# Altium schematic sheet РЕУН.468172.001_Драйвер лазера.SchDoc: =Name-1str
size 594 x 420 mm; SheetNumber: номер страницы; Вид изделия: Документация; Раздел: Документация; Код документа: Э3; Вид документа: Схема электрическая принципиальная; Класс документа: Конструкторский документ; Создавать изделие в PLM: Yes; DocumentCode: РЕУН.Э3; DocumentView: Схема электрическая принципиальная; DocumentClass: Конструкторский документ; ProductView: Документация
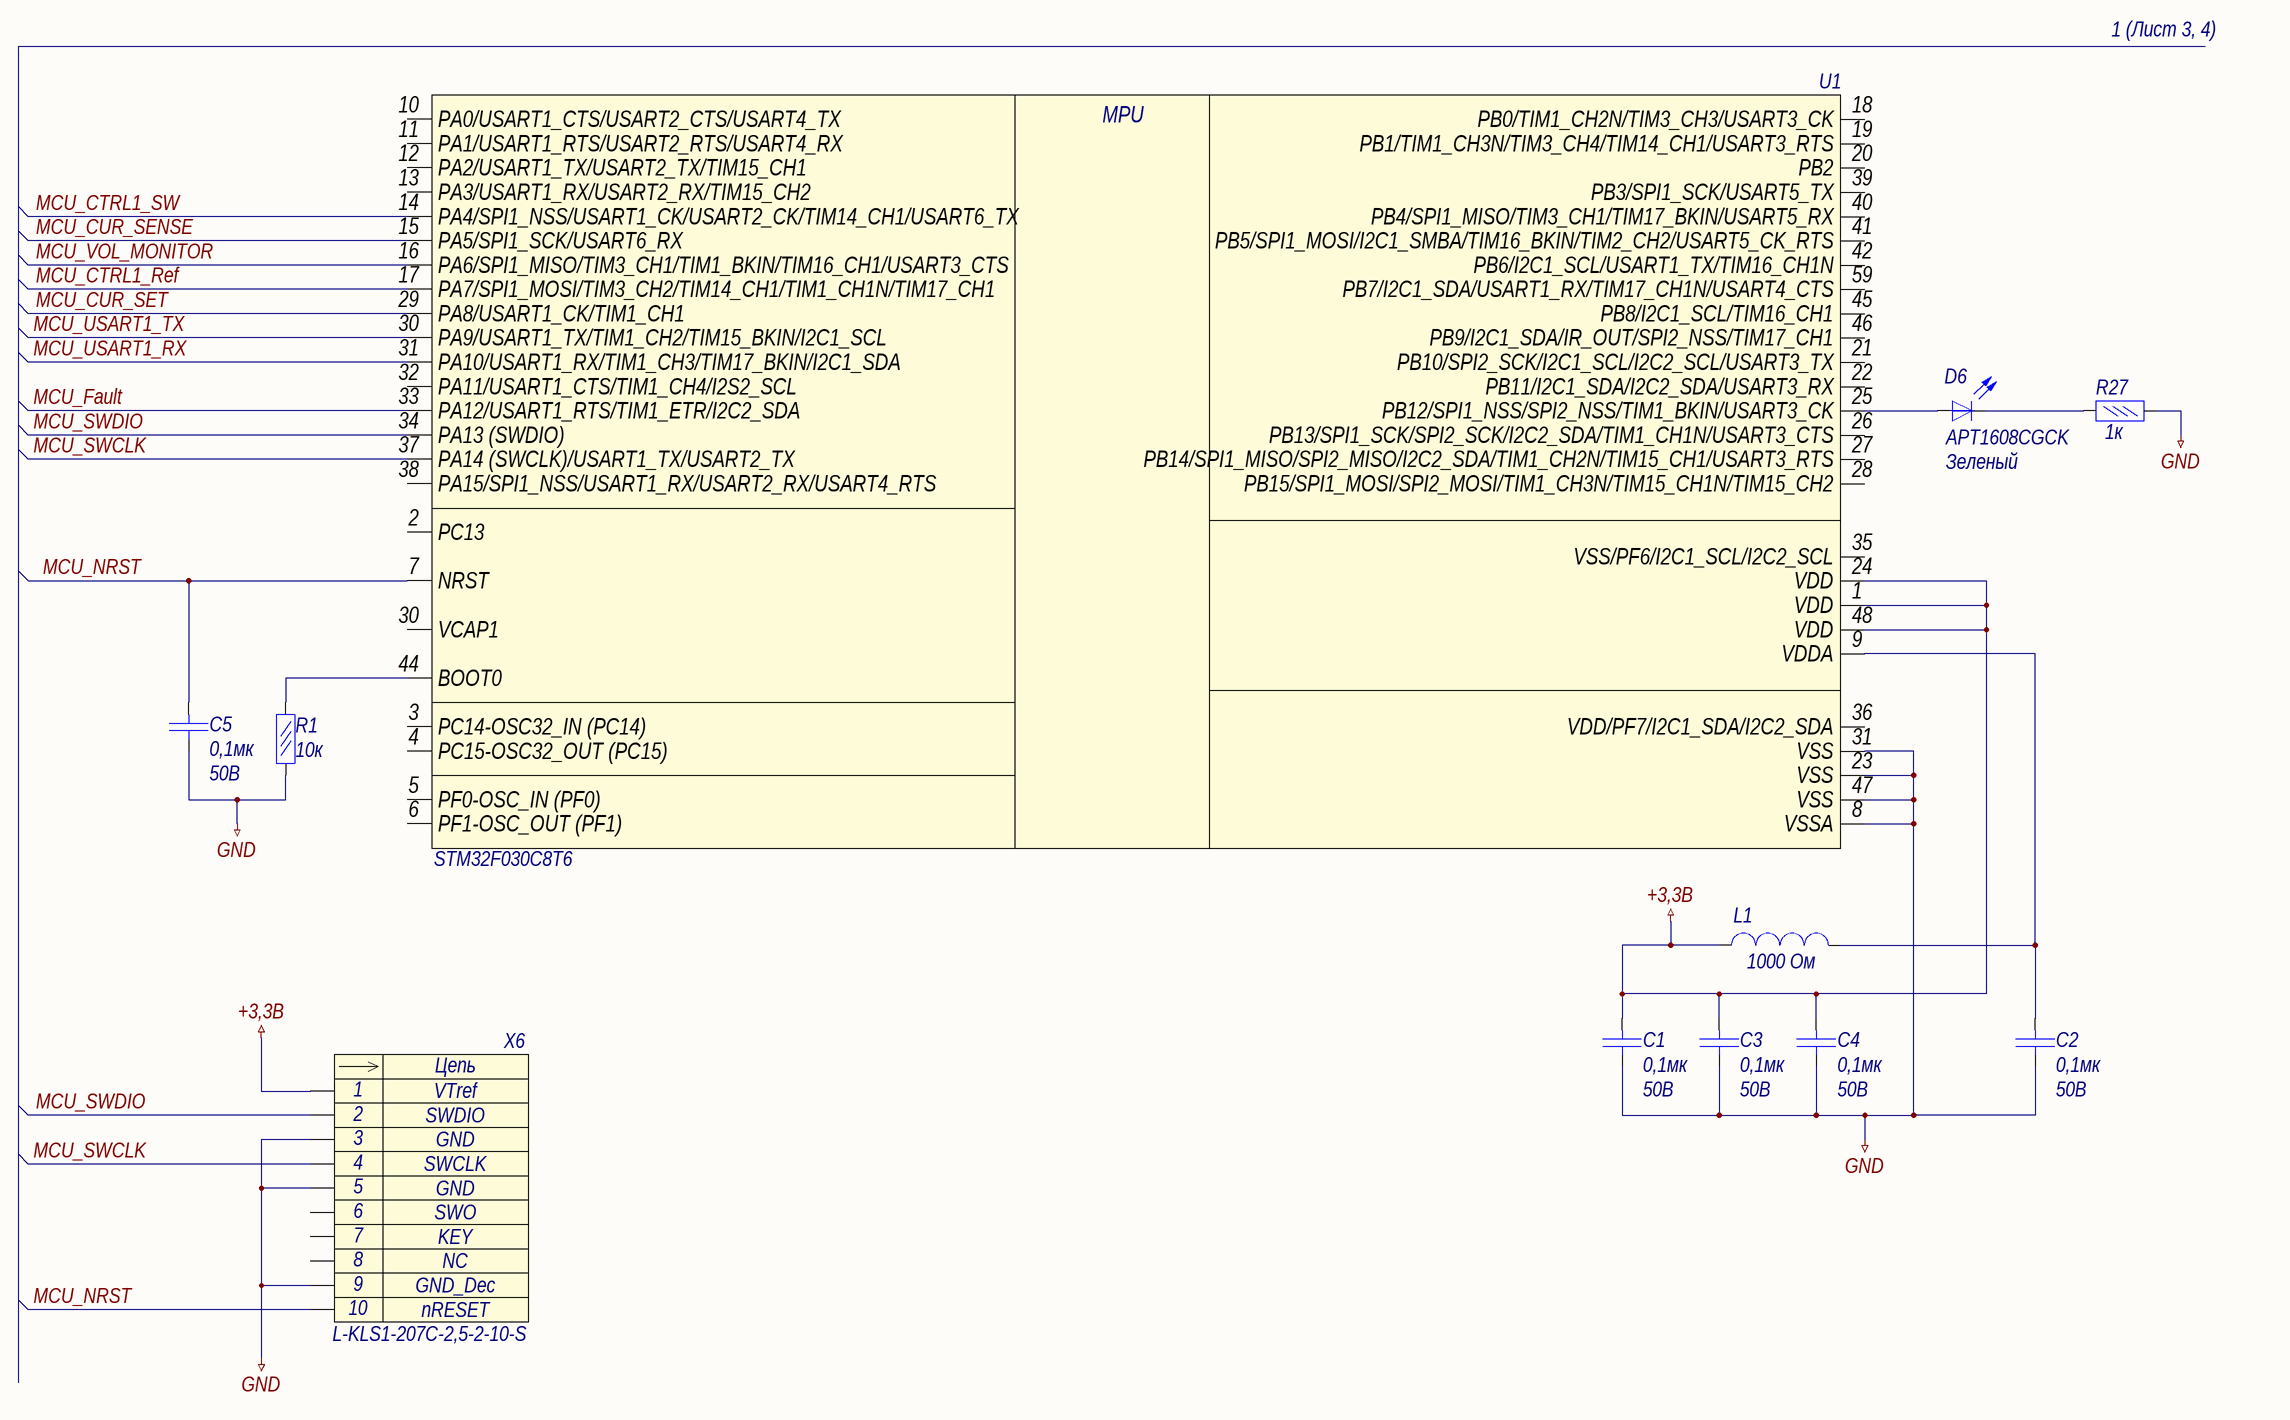
[diagram p0: РЕУН.468172.001_Драйвер лазера.SchDoc]

## Parts
C1  Voltage: 50В  [C0805_AA]  (hidden comment: 0,1мк)
C2  Voltage: 50В  [C0805_AA]  (hidden comment: 0,1мк)
C3  Voltage: 50В  [C0805_AA]  (hidden comment: 0,1мк)
C4  Voltage: 50В  [C0805_AA]  (hidden comment: 0,1мк)
C5  Voltage: 50В  [C0805_AA]  (hidden comment: 0,1мк)
D6  Color: Зеленый  (hidden comment: APT1608CGCK)
L1  1000 Ом  [L0603_A]
R1  10к  [R1206]
R27  1к  [R1206]
U1  STM32F030C8T6
X6  L-KLS1-207C-2,5-2-10-S

## Nets
+3,3В: C1.2 C3.2 C4.2 L1.1 U1.1(VDD) U1.24(VDD) U1.48(VDD) X6.1
GND: C1.1 C2.1 C3.1 C4.1 C5.1 R1.1 R27.1 U1.8(VSSA) U1.23(VSS) U1.31(VSS) U1.47(VSS) X6.3 X6.5 X6.9
MCU_CTRL1_Ref: U1.17(PA7/SPI1_MOSI/TIM3_CH2/TIM14_CH1/TIM1_CH1N/TIM17_CH1)
MCU_CTRL1_SW: U1.14(PA4/SPI1_NSS/USART1_CK/USART2_CK/TIM14_CH1/USART6_TX)
MCU_CUR_SENSE: U1.15(PA5/SPI1_SCK/USART6_RX)
MCU_CUR_SET: U1.29(PA8/USART1_CK/TIM1_CH1)
MCU_Fault: U1.33(PA12/USART1_RTS/TIM1_ETR/I2C2_SDA)
MCU_NRST: C5.2 U1.7(NRST) X6.10
MCU_SWCLK: U1.37(PA14_(SWCLK)/USART1_TX/USART2_TX) X6.4
MCU_SWDIO: U1.34(PA13_(SWDIO)) X6.2
MCU_USART1_RX: U1.31(PA10/USART1_RX/TIM1_CH3/TIM17_BKIN/I2C1_SDA)
MCU_USART1_TX: U1.30(PA9/USART1_TX/TIM1_CH2/TIM15_BKIN/I2C1_SCL)
MCU_VOL_MONITOR: U1.16(PA6/SPI1_MISO/TIM3_CH1/TIM1_BKIN/TIM16_CH1/USART3_CTS)
NetC2_2: C2.2 L1.2 U1.9(VDDA)
NetD6_1: D6.1(A) U1.25(PB12/SPI1_NSS/SPI2_NSS/TIM1_BKIN/USART3_CK)
NetD6_2: D6.2(K) R27.2
NetR1_2: R1.2 U1.44(BOOT0)

Not connected (* = marked no-connect by the designer): U1 2(PC13) 3(PC14-OSC32_IN_(PC14)) 4(PC15-OSC32_OUT_(PC15)) 5(PF0-OSC_IN_(PF0)) 6(PF1-OSC_OUT_(PF1)) 10(PA0/USART1_CTS/USART2_CTS/USART4_TX) 11(PA1/USART1_RTS/USART2_RTS/USART4_RX) 12(PA2/USART1_TX/USART2_TX/TIM15_CH1) 13(PA3/USART1_RX/USART2_RX/TIM15_CH2) 18(PB0/TIM1_CH2N/TIM3_CH3/USART3_CK) 19(PB1/TIM1_CH3N/TIM3_CH4/TIM14_CH1/USART3_RTS) 20(PB2) 21(PB10/SPI2_SCK/I2C1_SCL/I2C2_SCL/USART3_TX) 22(PB11/I2C1_SDA/I2C2_SDA/USART3_RX) 26(PB13/SPI1_SCK/SPI2_SCK/I2C2_SDA/TIM1_CH1N/USART3_CTS) 27(PB14/SPI1_MISO/SPI2_MISO/I2C2_SDA/TIM1_CH2N/TIM15_CH1/USART3_RTS) 28(PB15/SPI1_MOSI/SPI2_MOSI/TIM1_CH3N/TIM15_CH1N/TIM15_CH2) 32(PA11/USART1_CTS/TIM1_CH4/I2S2_SCL) 35(VSS/PF6/I2C1_SCL/I2C2_SCL) 36(VDD/PF7/I2C1_SDA/I2C2_SDA) 38(PA15/SPI1_NSS/USART1_RX/USART2_RX/USART4_RTS) 39(PB3/SPI1_SCK/USART5_TX) 40(PB4/SPI1_MISO/TIM3_CH1/TIM17_BKIN/USART5_RX) 41(PB5/SPI1_MOSI/I2C1_SMBA/TIM16_BKIN/TIM2_CH2/USART5_CK_RTS) 42(PB6/I2C1_SCL/USART1_TX/TIM16_CH1N) 45(PB8/I2C1_SCL/TIM16_CH1) 46(PB9/I2C1_SDA/IR_OUT/SPI2_NSS/TIM17_CH1) 59(PB7/I2C1_SDA/USART1_RX/TIM17_CH1N/USART4_CTS); X6 6 7 8

## Notes on the sheet
- 1 (Лист 3, 4)
- Перв. примен.
- Справ. №
- Подп. и дата
- Инв. № дубл.
- Нормоконтроль:
- Взам. инв. №
- Изм.
- Лист
- № докум.
- Подп.
- Дата
- Лит.
- Масса
- Масштаб
- Т.контр.
- Пров.
- Разраб.
- Листов
- Разработал:
- Инв. № подл.
- Н.контр.
- Утв.
- Копировал
- Формат
- А2
- (in symbol STM32F030C8T6) MPU
- (in symbol x10-m) Цепь

## Library data of the parts
C1-C5 = Конденсатор кер.: Name: CC0603KRX7R9BB104; Value: 0,1мк
D6 = led: Светодиод; Name: APT1608CGCK
L1 = Inductor: Катушка индуктивности; Name: BLM18TG102TN1D; Value: 1000 Ом
R1 R27 = Резистор  0,05Вт: Резистор 0,05Вт; Name: RC0603FR-0710KL; Power rating: 0,05Вт
  R1: Value: 10к
  R27: Value: 1к
U1 = STM32F030C8T6: 32-битный микроконтроллер; Name: STM32F030C8T6
X6 = x10-m: Разъем - 10 конт. вилка; Contact_1: VTref; Contact_2: SWDIO; Contact_3: GND; Contact_4: SWCLK; Contact_6: SWO; Contact_7: KEY; Contact_8: NC; Contact_9: GND_Dec; Contact_10: nRESET; Contact_5: GND; Name: L-KLS1-207C-2,5-2-10-S